# Altium schematic sheet CTRL V5.SchDoc
size A3
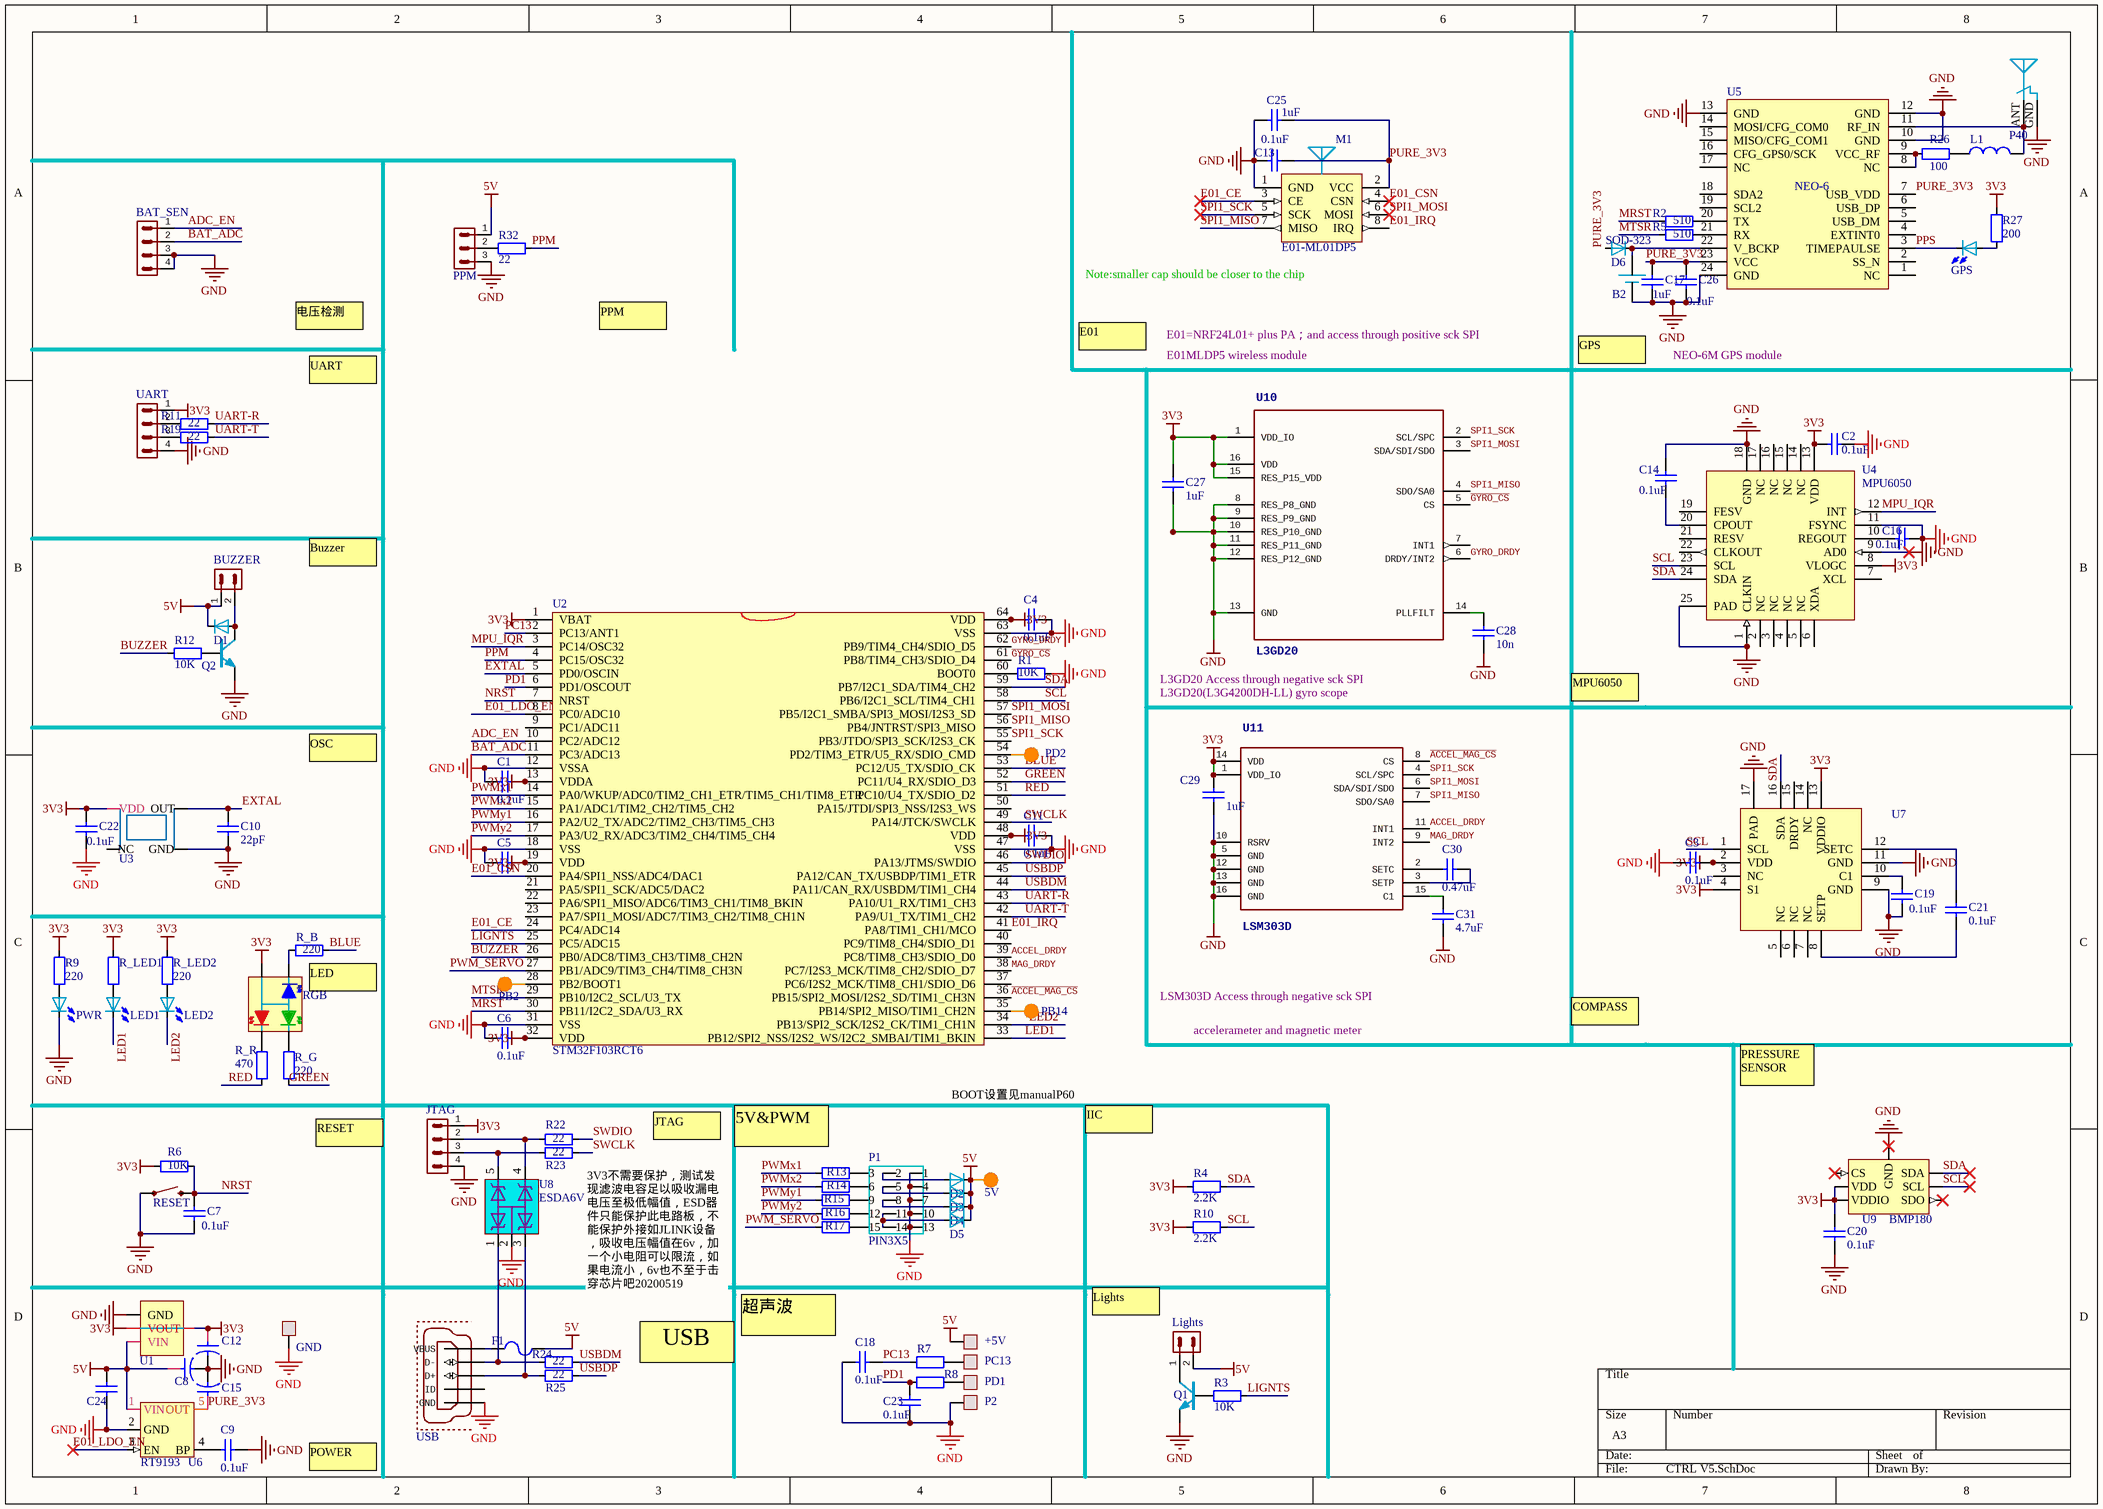
[diagram p0: CTRL V5.SchDoc]

## Parts
5V  voltage  [TEST_P]  (value not drawn)
+5V  voltage  [PIN1*1]  (value not drawn)
B2  XH414  [XH414]  (value not drawn)
BAT_SEN  DF13C-4P  [DF13C-4P-1.25V]  (value not drawn)
BUZZER  DF13C-2P  [DF13C-2P-1.25V]  (value not drawn)
C1  0.1uF  [0603-CAP]
C2  0.1uF  [0603-CAP]
C3  0.1uF  [0603-CAP]
C4  0.1uF  [0603-CAP]
C5  0.1uF  [0603-CAP]  (value not drawn)
C6  0.1uF  [0603-CAP]
C7  0.1uF  [0603-CAP]
C8  10uF  [TAJ-A(1206)[3216]]  (value not drawn)
C9  0.1uF  [0603-CAP]
C10  22pF  [0603-CAP]
C11  0.1uF  [0603-CAP]
C12  10uF  [TAJ-A(1206)[3216]]  (value not drawn)
C13  0.1uF  [0603-CAP]
C14  0.1uF  [0603-CAP]
C15  10uF  [TAJ-A(1206)[3216]]  (value not drawn)
C16  0.1uF  [0603-CAP]
C17  1uF  [0805-CAP]
C18  0.1uF  [0603-CAP]
C19  0.1uF  [0603-CAP]
C20  0.1uF  [0603-CAP]
C21  0.1uF  [0603-CAP]
C22  0.1uF  [0603-CAP]
C23  0.1uF  [0603-CAP]
C24  0.1uF  [0805-CAP]  (value not drawn)
C25  1uF  [0805-CAP]
C26  0.1uF  [0603-CAP]
C27  1uF  [0805-CAP]
C28  10n  [0603-CAP]
C29  1uF  [0805-CAP]
C30  0.47uF  [0603-CAP]
C31  4.7uF  [0805-CAP]
D1  shotechy  [SOD-323]  (value not drawn)
D2  1N4148  [SOD-523]  (value not drawn)
D3  1N4148  [SOD-523]  (value not drawn)
D4  1N4148  [SOD-523]  (value not drawn)
D5  1N4148  [SOD-523]  (value not drawn)
D6  SOD-323  [SOD-323]
F1  FUSE  [0805-FUS]  (value not drawn)
GND  voltage  [PIN1*1]  (value not drawn)
GPS  LED  [0805-LED]  (value not drawn)
JTAG  PIN HDR 1x4  [PIN4*1]  (value not drawn)
L1  value  [0805-IND]  (value not drawn)
LED1  LED  [0805-LED]  (value not drawn)
LED2  LED  [0805-LED]  (value not drawn)
Lights  DF13C-2P  [DF13C-2P-1.25V]  (value not drawn)
M1  E01-ML01DP5  [E01-ML01DP5 - SMD]
P1  PIN3X5  [PIN HDR3X5]
P2  voltage  [PIN1*1]  (value not drawn)
P40  IPEX  [IPEX]  (value not drawn)
PB2  voltage  [TEST_P]  (value not drawn)
PB14  voltage  [TEST_P]  (value not drawn)
PC13  voltage  [PIN1*1]  (value not drawn)
PD1  voltage  [PIN1*1]  (value not drawn)
PD2  voltage  [TEST_P]  (value not drawn)
PPM  PIN HDR 1X3  [PIN3*1]  (value not drawn)
PWR  LED  [0805-LED]  (value not drawn)
Q1  2N3904  [SOT-23]  (value not drawn)
Q2  2N3904  [SOT-23]  (value not drawn)
R1  10K  [0603-Res]
R2  510  [0603-Res]
R3  10K  [0603-Res]
R4  2.2K  [0603-Res]
R5  510  [0603-Res]
R6  10K  [0603-Res]
R7  220  [0603-Res]  (value not drawn)
R8  220  [0603-Res]  (value not drawn)
R9  220  [0603-Res]
R10  2.2K  [0603-Res]
R11  22  [0603-Res]
R12  10K  [0603-Res]
R13  220  [0603-Res]  (value not drawn)
R14  220  [0603-Res]  (value not drawn)
R15  220  [0603-Res]  (value not drawn)
R16  220  [0603-Res]  (value not drawn)
R17  220  [0603-Res]  (value not drawn)
R19  22  [0603-Res]
R22  22  [0603-Res]
R23  22  [0603-Res]
R24  22  [0603-Res]
R25  22  [0603-Res]
R26  100  [0603-Res]
R27  200  [0603-Res]
R32  22  [0603-Res]
R_B  220  [0603-Res]
R_G  220  [0603-Res]
R_LED1  220  [0603-Res]  (value not drawn)
R_LED2  220  [0603-Res]
R_R  470  [0603-Res]
RESET  KEY_2PIN  [KEY-SMD-2P-1]  (value not drawn)
RGB  3528LED  [1210-RGBLED]  (value not drawn)
U1  AMS1117-3.3  [SOT-223]  (value not drawn)
U2  STM32F103RCT6  [LQFP-64-S]
U3  5032-8M  [XTAL-5032-4P]  (value not drawn)
U4  MPU6050  [QFN-24]
U5  NEO-6  [NEO-6]
U6  RT9193  [SOT23-5]
U7  HMC5883  [QFN-16-L]  (value not drawn)
U8  ESDA6V1W5(Eb1)  [SOT323-5L]
U9  BMP180  [BMP180-WITHSHELL]
U10  L3GD20  [L3G4200DH-MAN]
U11  LSM303D  [LGA-16L]
UART  SH1.0-4P  [SH1.0 S-W-4P]  (value not drawn)
USB  USB-MICRO  [USB_MICRO]  (value not drawn)

## Nets
3V3: C1.1 C2.1 C3.2 C4.2 C5.2 C6.1 C11.2 C12.A C20.2 C22.2 C27.2 C29.2 JTAG.1 R4.2 R6.1 R9.1 R10.2 R27.2 R_LED1.1 R_LED2.1 RGB.VCC U1.2(VOUT) U1.4(VOUT) U2.1(VBAT) U2.13(VDDA) U2.19(VDD) U2.32(VDD) U2.48(VDD) U2.64(VDD) U3.4(VDD) U4.8(VLOGC) U4.13(VDD) U7.2(VDD) U7.4(S1) U7.13(VDDIO) U9.2(VDD) U9.3(VDDIO) U10.1(VDD_IO) U10.15(RES_P15_VDD) U10.16(VDD) U11.1(VDD_IO) U11.14(VDD) UART.1
5V: 5V.1 +5V.1 BUZZER.1 C8.A C24.2 D1.C D2.C D3.C D4.C D5.C F1.1 Lights.2 PPM.1 U1.3(VIN) U6.1(VIN)
GND: B2.GND BAT_SEN.3 BAT_SEN.4 C1.2 C2.2 C3.1 C4.1 C5.1 C6.2 C7.1 C8.C(K) C9.2 C10.1 C11.1 C12.C(K) C13.1 C14.2 C15.C(K) C16.2 C17.1 C18.1 C19.1 C20.1 C22.1 C23.1 C24.1 C25.2 C26.1 C27.1 C28.1 C29.1 C31.1 GND.1 JTAG.4 M1.1(GND) P1.1 P1.4 P1.7 P1.10 P1.13 P2.1 P40.GND PPM.3 PWR.C Q1.1 Q2.1 R1.1 RESET.1 U1.1(GND) U2.12(VSSA) U2.18(VSS) U2.31(VSS) U2.47(VSS) U2.63(VSS) U3.2(GND) U4.1(CLKIN) U4.9(AD0) U4.11(FSYNC) U4.18(GND) U4.25(PAD) U5.10(GND) U5.12(GND) U5.13(GND) U5.24(GND) U6.2(GND) U7.9(GND) U7.11(GND) U7.17(PAD) U8.2(GND) U9.7(GND) U10.8(RES_P8_GND) U10.9(RES_P9_GND) U10.10(RES_P10_GND) U10.11(RES_P11_GND) U10.12(RES_P12_GND) U10.13(GND) U11.5(GND) U11.10(RSRV) U11.12(GND) U11.13(GND) U11.16(GND) UART.4 USB.GND
~{ACCEL_MAG_CS}: U2.36(PB15/SPI2_MOSI/I2S2_SD/TIM1_CH3N) U11.8(CS)
ACCEL_DRDY: U2.39(PC8/TIM8_CH3/SDIO_D0) U11.11(INT1)
ADC_EN: BAT_SEN.1 U2.10(PC2/ADC12)
BAT_ADC: BAT_SEN.2 U2.11(PC3/ADC13)
BLUE: R_B.2 U2.53(PC12/U5_TX/SDIO_CK)
BUZZER: R12.2 U2.26(PB0/ADC8/TIM3_CH3/TIM8_CH2N)
E01_CE: M1.3(CE) U2.24(PC4/ADC14)
E01_CSN: M1.4(CSN) U2.20(PA4/SPI1_NSS/ADC4/DAC1)
E01_IRQ: M1.8(IRQ) U2.41(PA8/TIM1_CH1/MCO)
E01_LDO_EN: U2.8(PC0/ADC10) U6.3(EN)
EXTAL: C10.2 U2.5(PD0/OSCIN) U3.3(OUT)
~{GYRO_CS}: U2.61(PB8/TIM4_CH3/SDIO_D4) U10.5(CS)
GREEN: R_G.2 U2.52(PC11/U4_RX/SDIO_D3)
GYRO_DRDY: U2.62(PB9/TIM4_CH4/SDIO_D5) U10.6(DRDY/INT2)
LED1: LED1.C U2.33(PB12/SPI2_NSS/I2S2_WS/I2C2_SMBAI/TIM1_BKIN)
LED2: LED2.C U2.34(PB13/SPI2_SCK/I2S2_CK/TIM1_CH1N)
LIGNTS: R3.1 U2.25(PC5/ADC15)
MAG_DRDY: U2.38(PC7/I2S3_MCK/TIM8_CH2/SDIO_D7) U11.9(INT2)
MPU_IQR: U2.3(PC14/OSC32) U4.12(INT)
MRST: R2.1 U2.30(PB11/I2C2_SDA/U3_RX)
MTSR: R5.1 U2.29(PB10/I2C2_SCL/U3_TX)
NRST: C7.2 R6.2 RESET.2 U2.7(NRST)
PC13: C18.2 R7.1 U2.2(PC13/ANT1)
PD1: C23.2 R8.1 U2.6(PD1/OSCOUT)
PPM: R32.1 U2.4(PC15/OSC32)
PPS: GPS.C U5.3(TIMEPAULSE)
PURE_3V3: C13.2 C15.A C17.2 C25.1 C26.2 D6.A M1.2(VCC) U5.7(USB_VDD) U5.23(VCC) U6.5(OUT)
PWM_SERVO: R17.2 U2.27(PB1/ADC9/TIM3_CH4/TIM8_CH3N)
PWMx1: R13.2 U2.14(PA0/WKUP/ADC0/TIM2_CH1_ETR/TIM5_CH1/TIM8_ETR)
PWMx2: R14.2 U2.15(PA1/ADC1/TIM2_CH2/TIM5_CH2)
PWMy1: R15.2 U2.16(PA2/U2_TX/ADC2/TIM2_CH3/TIM5_CH3)
PWMy2: R16.2 U2.17(PA3/U2_RX/ADC3/TIM2_CH4/TIM5_CH4)
RED: R_R.2 U2.51(PC10/U4_TX/SDIO_D2)
SCL: R10.1 U2.58(PB6/I2C1_SCL/TIM4_CH1) U4.23(SCL) U7.1(SCL) U9.5(SCL)
SDA: R4.1 U2.59(PB7/I2C1_SDA/TIM4_CH2) U4.24(SDA) U7.16(SDA) U9.6(SDA)
SPI1_MISO: M1.7(MISO) U2.56(PB4/JNTRST/SPI3_MISO) U10.4(SDO/SA0) U11.7(SDO/SA0)
SPI1_MOSI: M1.6(MOSI) U2.57(PB5/I2C1_SMBA/SPI3_MOSI/I2S3_SD) U10.3(SDA/SDI/SDO) U11.6(SDA/SDI/SDO)
SPI1_SCK: M1.5(SCK) U2.55(PB3/JTDO/SPI3_SCK/I2S3_CK) U10.2(SCL/SPC) U11.4(SCL/SPC)
SWCLK: R23.2 U2.49(PA14/JTCK/SWCLK)
SWDIO: R22.2 U2.46(PA13/JTMS/SWDIO)
UART-R: R11.2 U2.43(PA10/U1_RX/TIM1_CH3)
UART-T: R19.2 U2.42(PA9/U1_TX/TIM1_CH2)
USBDM: R24.2 U2.44(PA11/CAN_RX/USBDM/TIM1_CH4)
USBDP: R25.2 U2.45(PA12/CAN_TX/USBDP/TIM1_ETR)
NetB2_VCC: B2.VCC D6.C U5.22(V_BCKP)
NetBUZZER_2: BUZZER.2 D1.A Q2.3
NetC9_1: C9.1 U6.4(BP)
NetC14_1: C14.1 U4.20(CPOUT)
NetC16_1: C16.1 U4.10(REGOUT)
NetC19_2: C19.2 U7.10(C1)
NetC21_1: C21.1 U7.8(SETP)
NetC21_2: C21.2 U7.12(SETC)
NetC28_2: C28.2 U10.14(PLLFILT)
NetC30_1: C30.1 U11.3(SETP)
NetC30_2: C30.2 U11.2(SETC)
NetC31_2: C31.2 U11.15(C1)
NetD2_A: D2.A P1.2
NetD3_A: D3.A P1.5
NetD4_A: D4.A P1.8
NetD5_A: D5.A P1.11 P1.14
NetF1_2: F1.2 USB.VBUS
NetGPS_A: GPS.A R27.1
NetJTAG_2: JTAG.2 R22.1 U8.4(D3)
NetJTAG_3: JTAG.3 R23.1 U8.5(D4)
NetL1_1: L1.1 R26.2
NetL1_2: L1.2 P40.ANT U5.11(RF_IN)
NetLED1_A: LED1.A R_LED1.2
NetLED2_A: LED2.A R_LED2.2
NetLights_1: Lights.1 Q1.3
NetP1_3: P1.3 R13.1
NetP1_6: P1.6 R14.1
NetP1_9: P1.9 R15.1
NetP1_12: P1.12 R16.1
NetP1_15: P1.15 R17.1
NetPB2_1: PB2.1 U2.28(PB2/BOOT1)
NetPB14_1: PB14.1 U2.35(PB14/SPI2_MISO/TIM1_CH2N)
NetPC13_1: PC13.1 R7.2
NetPD1_1: PD1.1 R8.2
NetPD2_1: PD2.1 U2.54(PD2/TIM3_ETR/U5_RX/SDIO_CMD)
NetPPM_2: PPM.2 R32.2
NetPWR_A: PWR.A R9.2
NetQ1_2: Q1.2 R3.2
NetQ2_2: Q2.2 R12.1
NetR1_2: R1.2 U2.60(BOOT0)
NetR2_2: R2.2 U5.20(TX)
NetR5_2: R5.2 U5.21(RX)
NetR11_1: R11.1 UART.2
NetR19_1: R19.1 UART.3
NetR24_1: R24.1 U8.1(D1) USB.D-
NetR25_1: R25.1 U8.3(D2) USB.D+
NetR26_1: R26.1 U5.8(NC) U5.9(VCC_RF)
NetR_B_1: R_B.1 RGB.B
NetR_G_1: R_G.1 RGB.G
NetR_R_1: R_R.1 RGB.R

Not connected (* = marked no-connect by the designer): U2 9(PC1/ADC11) 21(PA5/SPI1_SCK/ADC5/DAC2) 22(PA6/SPI1_MISO/ADC6/TIM3_CH1/TIM8_BKIN) 23(PA7/SPI1_MOSI/ADC7/TIM3_CH2/TIM8_CH1N) 37(PC6/I2S2_MCK/TIM8_CH1/SDIO_D6) 40(PC9/TIM8_CH4/SDIO_D1) 50(PA15/JTDI/SPI3_NSS/I2S3_WS); U3 1(NC); U4 2(NC) 3(NC) 4(NC) 5(NC) 6(XDA) 7(XCL) 14(NC) 15(NC) 16(NC) 17(NC) 19(FESV) 21(RESV) 22(CLKOUT); U5 1(NC) 2(SS_N) 4(EXTINT0) 5(USB_DM) 6(USB_DP) 14(MOSI/CFG_COM0) 15(MISO/CFG_COM1) 16(CFG_GPS0/SCK) 17(NC) 18(SDA2) 19(SCL2); U7 3(NC) 5(NC) 6(NC) 7(NC) 14(NC) 15(DRDY); U9 1(CS)* 4(SDO)*; U10 7(INT1); USB ID

## Notes on the sheet
- (near M1) Note:smaller cap should be closer to the chip
- 电压检测
- UART
- PPM
- E01
- E01MLDP5 wireless module
- E01=NRF24L01+ plus PA；and access through positive sck SPI
- GPS
- NEO-6M GPS module
- Buzzer
- L3GD20 Access through negative sck SPI
- L3GD20(L3G4200DH-LL) gyro scope
- MPU6050
- OSC
- LED
- LSM303D Access through negative sck SPI
- accelerameter and magnetic meter
- COMPASS
- BOOT设置见manualP60
- IIC
- PRESSURE SENSOR
- RESET
- JTAG
- 5V&PWM
- 3V3不需要保护，测试发现滤波电容足以吸收漏电电压至极低幅值，ESD器件只能保护此电路板，不能保护外接如JLINK设备，吸收电压幅值在6v，加一个小电阻可以限流，如果电流小，6v也不至于击穿芯片吧20200519
- Lights
- USB
- (near C18) 超声波
- POWER

## Library data of the parts
5V PB2 PB14 PD2 = TEST: 信号测试点
+5V GND P2 PC13 PD1 = PIN HDR 1x1
B2 = XH414: XH414贴片法拉电容φ4.7
BAT_SEN = PIN HDR 1x4: 1x4-Pin-connector; LatestRevisionDate: 17-Jul-2002; LatestRevisionNote: Re-released for DXP Platform.; Publisher: Altium Limited
BUZZER = PIN HDR 1x2: DF13C-2PHeader, 2-Pin; LatestRevisionDate: 17-Jul-2002; LatestRevisionNote: Re-released for DXP Platform.; Publisher: Altium Limited
C1-C7 C9 C11 C13 C14 C16 C18-C24 C26 = Cap: 无极性Cap; Voltage: 50V; Published: 8-Jun-2000; LatestRevisionDate: 17-Jul-2002; LatestRevisionNote: Re-released for DXP Platform.; PackageReference: RAD-0.3; Publisher: Altium Limited; PackageDescription: Radial Cap, Thru-Hole; 2 Leads; 0.3 in Pin Spacing; Footprint: 0603; Value: 0.1uF
C8 C12 C15 = Cap_p: 有极性Cap
C10 C17 C25 C27-C31 = Cap: 无极性Cap; Voltage: 50V; Value: 0.1uF; Published: 8-Jun-2000; LatestRevisionDate: 17-Jul-2002; LatestRevisionNote: Re-released for DXP Platform.; PackageReference: RAD-0.3; Publisher: Altium Limited; PackageDescription: Radial Cap, Thru-Hole; 2 Leads; 0.3 in Pin Spacing; Footprint: 0603
D1-D6 = DIODE
F1 = FUSE: 熔断器
JTAG = PIN HDR 1x4: 1x4-Pin-connector-JTAG; LatestRevisionDate: 17-Jul-2002; LatestRevisionNote: Re-released for DXP Platform.; Publisher: Altium Limited
L1 = Inductor: 电感
Lights = PIN HDR 1x2: Header, 2-Pin; LatestRevisionDate: 17-Jul-2002; LatestRevisionNote: Re-released for DXP Platform.; Publisher: Altium Limited
M1 = E01-ML01DP5: 无线模块E01-ML01DP5
P1 = PIN HDR3x5
P40 = IPEX: IPEX天线座
Q1 Q2 = NPN: NPN三极管
R1 R3 R4 R6 R9-R17 R19 R22-R27 R32 R_B R_G R_LED1 R_LED2 R_R = Res: Resistor; Value: 1K; Published: 8-Jun-2000; LatestRevisionDate: 17-Jul-2002; LatestRevisionNote: Re-released for DXP Platform.; PackageReference: AXIAL-0.4; Publisher: Altium Limited; Footprint: 0603
R2 R5 R7 R8 = RES: Resistor; Value: 1K; Published: 8-Jun-2000; LatestRevisionDate: 17-Jul-2002; LatestRevisionNote: Re-released for DXP Platform.; PackageReference: AXIAL-0.4; Publisher: Altium Limited
RGB = LED-RGB-4PIN
U1 = AMS1117
U3 = XTAL-5032-4P: 4PIN-5032晶振
U4 = MPU6050: dscrps三轴陀螺仪加速度计
U5 = NEO-6: GPS
U7 = HMC5883: 地磁计
U8 = ESDA6V1W5(Eb1): ESD protection
U9 = BMP180: Special BOSCH pressure sensor
U10 = L3G4200DH-LL: <h3>L3G4200DH - Digital 3-axis Gyroscope</h3> / The L3G4200DH is a low-power three-axis / angular rate sensor. The L3G4200DH has a full scale of ±250/±500/ / ±2000 dps and is capable of measuring rates with / a user-selectable bandwidth. It can operate within a / temperature range from -40 °C to +85 °C. Supply voltage: 2.4 V to 3.6 V. Full datasheet:<br /><br /> / <a href="http://www.st.com/stonline/products/literature/ds/17300.pdf">L3G4200DH Datasheet</a>; PARTNO: L3GD20
U11 = LSM303D: <b>LSM303D Ultra compact high performance e-compass: 3D accelerometer and 3D magnetometer module</b>; DATASHEET: http://www.st.com/internet/com/TECHNICAL_RESOURCES/TECHNICAL_LITERATURE/DATASHEET/DM00057547.pdf; LINK: http://www.st.com/internet/analog/product/253884.jsp; MFGPN: LSM303D; PARTNO: LSM303D
UART = PIN HDR 1x4: SH1.0-4P 1x4-Pin-connector; LatestRevisionDate: 17-Jul-2002; LatestRevisionNote: Re-released for DXP Platform.; Publisher: Altium Limited
USB = USB